# Altium schematic sheet Voltage Supervisor.SchDoc: Voltage Supervisor
size A4; Date: Dec. 27th, 2022; Author: Karl Asseily; DrawnBy: Karl Asseily; DocumentNumber: 202301140903; Revision: 1.2; SheetNumber: 14; SheetTotal: 20
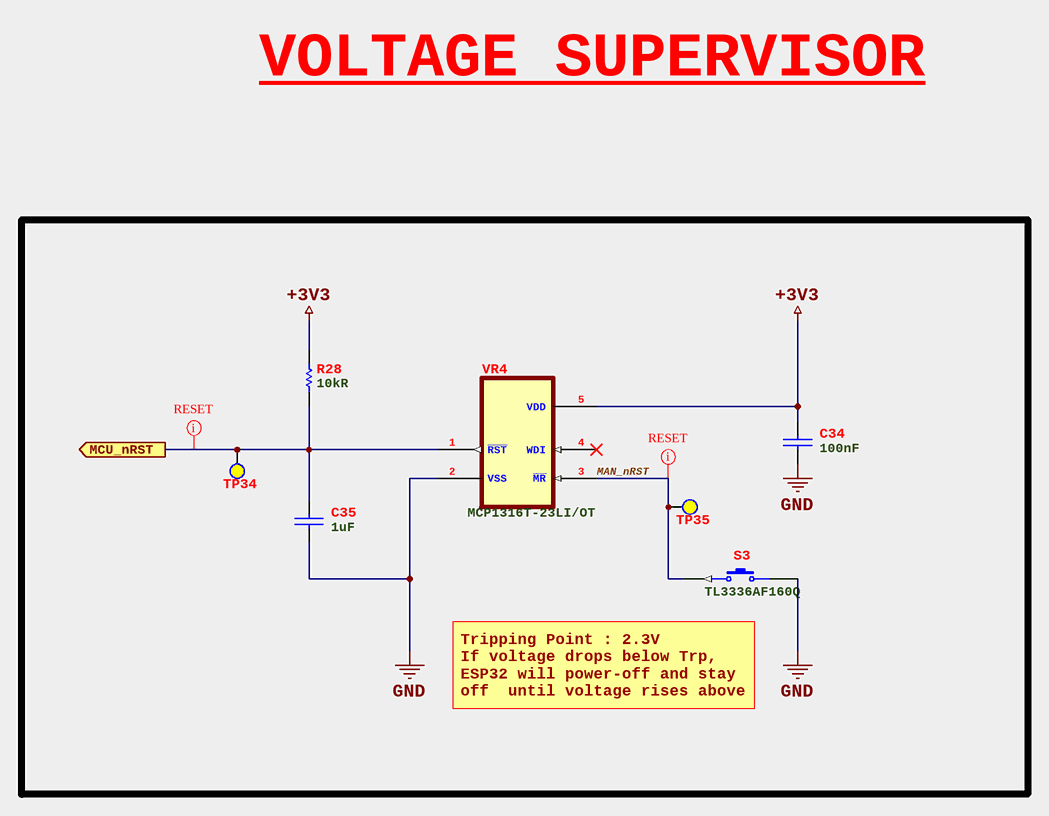
[diagram p0: Voltage Supervisor.SchDoc]

## Parts
C34  100nF  [CAP_0603]
C35  1uF  [CAP_0805]
R28  10kR  [RES_0603]
S3  TL3336AF160Q  [SW-TACTILE-SPST_TL3336]
TP34  MCU_nRST  [TEST POINT HOLE]  (value not drawn)  (no BOM)
TP35  MAN_nRST  [TEST POINT HOLE]  (value not drawn)  (no BOM)
VR4  MCP1316T-23LI/OT  [REG_SOT95P280X145-5N]

## Ports
MCU_nRST (out, see Main Controller Unit, ESP32 Processor)

## Nets
+3V3: C34.1 R28.2 VR4.5(VDD)
GND: C34.2 C35.2 S3.2 VR4.2(VSS)
MAN_nRST: S3.1 TP35.TP VR4.3(~{MR})
MCU_nRST: C35.1 R28.1 TP34.TP VR4.1(~{RST}) ; port MCU_nRST

Not connected (* = marked no-connect by the designer): VR4 4(WDI)*

## Layout directives
net class RESET: MAN_nRST, MCU_nRST

## Notes on the sheet
- VOLTAGE SUPERVISOR
- (near S3) Tripping Point : 2.3V
  If voltage drops below Trp, ESP32 will power-off and stay off  until voltage rises above 2.3V.
- Project
- Sheet
- Size
- Filename
- A4
- of
- Number
- Drawn By
- Rev.
- Variant
- Date

## Library data of the parts
C34 = CAP_0.1uF-50V-10%_0603: 0.1 µF ±10% 50V Ceramic Capacitor X7R 0603 (1608 Metric); Manufacturer: Yageo; Manufacturer Part Number: CC0603KRX7R9BB104; Supplier 1: Digi-Key; RoHS: Yes; Category: Ceramic Capacitors; Stock 1: 10054527; Pricing 1: 1=0.10000, 10=0.05400, 50=0.02960, 100=0.02430, 500=0.01732, 1000=0.01361 (USD); Mounting Technology: Surface Mount; Case/Package: 0603; Pins: 2; Case Code (Metric): 1608; Case Code (Imperial): 0603; Dielectric Material: Ceramic; Min Operating Temperature: -55°C; Max Operating Temperature: 125°C; Package Quantity: 1; Capacitance: 100nF; Voltage Rating: 50V; Tolerance: 10%; Packaging: Tape and Reel; Dielectric: X7R; Termination: SMD/SMT; Voltage: 50V; Series: CC; Length: 0.063inch; Width: 0.031inch; Height: 0.8mm; Thickness: 0.035inch; Depth: 0.8mm; Radiation Hardening: No; Reach SVHC Compliant: Yes; Lead Free: Lead Free; Halogen Free: Halogen Free; RoHS Compliant: Yes; ComponentLink1URL: C:\Users\Public\Documents\Altium\Projects\Cellar_Watchdog\Docs\Capacitor\UPY-GPHC_X7R_6.3V-to-250V_22.pdf; ComponentLink1Description: Datasheet; Supplier Part Number 2: 603-CC603KRX7R9BB104; Supplier Part Number 1: 311-1344-1-ND; Supplier 2: Mouser
C35 = CAP_1uF-16V-10%_0603: 1 µF ±10% 16V Ceramic Capacitor X7R 0603 (1608 Metric); Manufacturer: Yageo; Manufacturer Part Number: CC0603KRX7R7BB105; Dissipation Factor: 5%; Supplier 1: Digi-Key; RoHS: Yes; Category: Ceramic Capacitors; Stock 1: 10491943; Pricing 1: 1=0.14000, 10=0.09800, 50=0.05560, 100=0.04610, 500=0.03234, 1000=0.02678 (USD); Mounting Technology: Surface Mount; Case/Package: 0603; Pins: 2; Case Code (Metric): 1608; Case Code (Imperial): 0603; Min Operating Temperature: -55°C; Max Operating Temperature: 125°C; Capacitance: 1uF; Tolerance: 10%; Dielectric: X7R; Voltage Rating: 16V; Package Quantity: 1; Packaging: Tape and Reel; Voltage Rating (DC): 16V; Termination: SMD/SMT; Resistor Type: Ceramic; Voltage: 16V; Series: CC; Construction: Flat; Length: 1.6mm; Width: 0.031inch; Height: 0.8mm; Thickness: 0.035inch; Depth: 0.8mm; Radiation Hardening: No; Lead Free: Lead Free; Halogen Free: Halogen Free; RoHS Compliant: Yes; ComponentLink1URL: C:\Users\Public\Documents\Altium\Projects\Cellar_Watchdog\Docs\Capacitor\UPY-GPHC_X7R_6.3V-to-250V_22.pdf; ComponentLink1Description: Datasheet; Supplier 2: Mouser; Supplier Part Number 1: 311-1446-1-ND; Supplier Part Number 2: 603-CC603KRX7R7BB105
R28 = RES_10kR-100mW-1%_0603: 10 kOhms ±1% 0.1W, 1/10W Chip Resistor 0603 (1608 Metric) Moisture Resistant Thick Film; Manufacturer: Yageo; Manufacturer Part Number: RC0603FR-0710KL; Temperature Coefficient: 100ppm/°C; Voltage Rating (DC): 50V; Power Rating: 100mW; Voltage Rating: 75V; Supplier 1: Digi-Key; RoHS: Yes; Category: Chip SMD Resistors; Stock 1: 43209622; Pricing 1: 1=0.10000, 10=0.02100, 100=0.00850, 1000=0.00383, 2500=0.00332 (USD); Case/Package: 0603; Pins: 2; Case Code (Imperial): 0603; Case Code (Metric): 1608; Weight: 7.1E-05oz; Min Operating Temperature: -55°C; Max Operating Temperature: 155°C; Tolerance: 1%; Resistor Type: Thick Film; Resistance: 10kR; Packaging: Tape and Reel; Termination: SMD/SMT; Features: Moisture Resistant; Series: RC; Max Power Dissipation: 100mW; Number of Terminations: 2; Resistance Tolerance: 1%; Construction: Rectangular; Length: 1.6mm; Width: 0.8mm; Height: 0.45mm; Depth: 0.8mm; Lead Pitch: 0.3mm; Reach SVHC Compliant: Yes; Lead Free: Lead Free; Military Standard: Not; RoHS Compliant: Yes; ComponentLink6URL: C:\Users\Public\Documents\Altium\Projects\Cellar_Watchdog\Docs\Resistor\PYu-RC_Group_51_RoHS_L_12.pdf; ComponentLink6Description: Datasheet; Supplier 2: Mouser; Supplier Part Number 1: 311-10.0KHRCT-ND; Supplier Part Number 2: 603-RC0603FR-0710KL
S3 = SW2-NO-SPST_TL3336AF160Q_SMD: Tactile Switch SPST-NO Side Actuated Surface Mount, Right Angle; Manufacturer: E-Switch; Supplier 1: Digi-Key; Manufacturer Part Number: TL3336AF160Q; RoHS: No; Category: Tactile Switches; Stock 1: 16874; Pricing 1: 1=0.49000, 10=0.47200, 25=0.45440, 100=0.39310, 250=0.35820 (USD); Supplier 2: Mouser; Supplier Part Number 1: 141-TL3336AF160QCT-ND; Supplier Part Number 2: 612-TL3336AF160Q; ComponentLink1Description: Datasheet; ComponentLink1URL: C:\Users\Public\Documents\Altium\Projects\Cellar_Watchdog\Docs\Switch\TL3336.pdf
TP34 TP35 = Test Point: PCB Test Point; ClassName: Test Point
  TP34: Value: MCU_nRST
  TP35: Value: MAN_nRST
VR4 = SUP_2.3V-ActiveLow-140ms_SOT23-5: Supervisor Push-Pull, Totem Pole 1 Channel SOT-23-5; Manufacturer: Microchip; Number of Voltages Monitored: 1; Reset Timeout: 140ms; Threshold Voltage: 2.3V; Supplier 1: Digi-Key; Manufacturer Part Number: MCP1316T-23LI/OT; RoHS: Yes; Category: Voltage Supervisors; Stock 1: 1812; Pricing 1: 1=0.86000, 25=0.76480 (USD); Mounting Technology: Surface Mount; Case/Package: SOT-23-5; Min Operating Temperature: -40°C; Max Operating Temperature: 85°C; Type: Simple Reset/Power-On Reset; Reset: Active Low; Packaging: Cut Tape; RoHS Compliant: Yes; ComponentLink1URL: C:\Users\Public\Documents\Altium\Projects\Cellar_Watchdog\Docs\IC Supervisor\MCP131X-2X-Voltage-Supervisor-DS20001985E.pdf; ComponentLink1Description: Datasheet; Supplier 2: Mouser; Supplier Part Number 1: MCP1316T-23LI/OTCT-ND; Supplier Part Number 2: 579-MCP1316T-23LI/OT